# Altium schematic sheet DC-042C-Z-2.5-A1_DC-042C-Z-2.5-A.schdoc.schdoc
size 127 x 101 mm
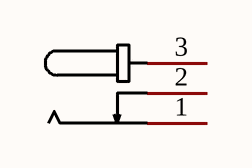
[diagram p0: DC-042C-Z-2.5-A1_DC-042C-Z-2.5-A.schdoc.schdoc]

## Parts
DC?  DC-042C-Z-2.5-A  [DC-IN-TH_DC-042C-Z-2.5-A]  (value not drawn)

## Nets

Not connected (* = marked no-connect by the designer): DC? 1 2 3

## Library data of the parts
DC? = DC-042C-Z-2.5-A: Manufacturer: XKB Connectivity(中国星坤); Add into BOM: yes; Connector Type: DC电源插座; Inside Contact Diameter: 2.5mm; Outside Contact Diameter: 6mm; Current Rating (Max): 10A; Voltage Rating (Max): 20V; Soldering Temperature(Max): 260℃; Symbol: DC-042C-Z-2.5-A; Device: DC-042C-Z-2.5-A; LCSC Part Name: DC电源插座 内径:2.5mm 外径:6mm 不带开关; Supplier Part: C706901; Manufacturer Part: DC-042C-Z-2.5-A; Supplier Footprint: 插件; JLCPCB Part Class: Extended Part; Datasheet: https://atta.szlcsc.com/upload/public/pdf/source/20211011/A75ED48B9CCFCCBC07979616CD543B30.pdf; Supplier: LCSC; Convert to PCB: yes; Mounting Style: 弯插; Contact Material: 黄铜; Operating Temperature Range: -20℃~+70℃